# EAGLE design tic_tac_toe_wire (EAGLE 6.4)
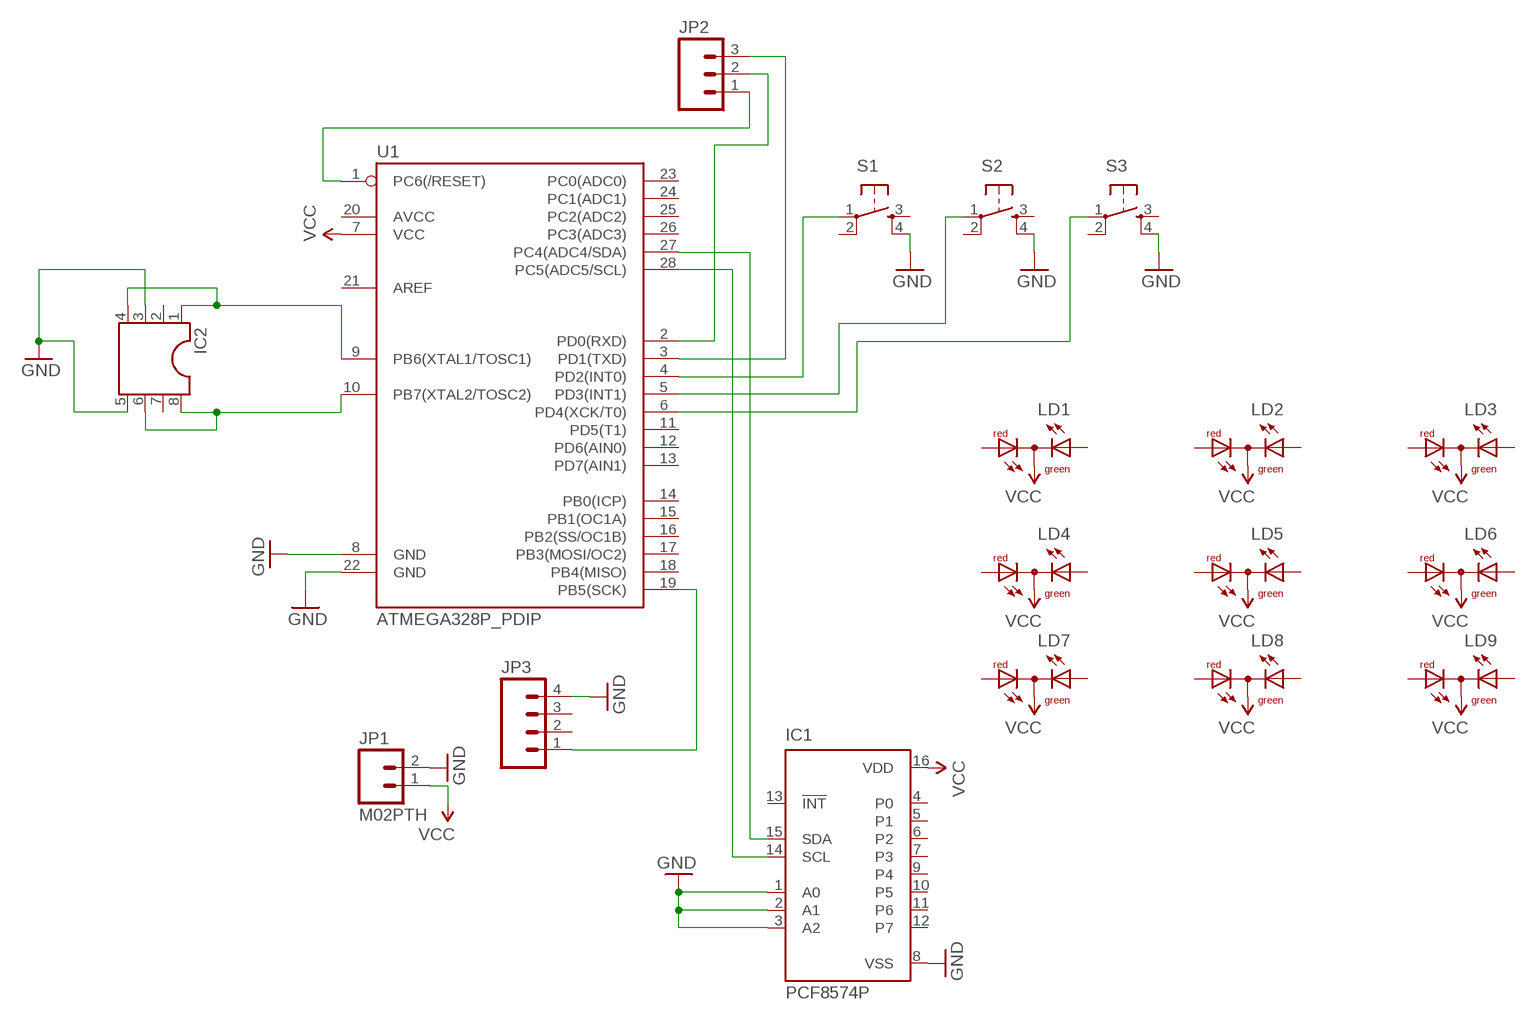
[diagram p0: schematic, sheet 1]

## Parts
IC1  PCF8574P  [DIL16]
IC2  DIL8S  [SOCKET-08]
JP1  M02PTH  [1X02]
JP2  M03PTH  [1X03]
JP3  M04PTH  [1X04]
LD1  DUOLED-RG-C  [DUOLED-C-5MM]
LD2  DUOLED-RG-C  [DUOLED-C-5MM]
LD3  DUOLED-RG-C  [DUOLED-C-5MM]
LD4  DUOLED-RG-C  [DUOLED-C-5MM]
LD5  DUOLED-RG-C  [DUOLED-C-5MM]
LD6  DUOLED-RG-C  [DUOLED-C-5MM]
LD7  DUOLED-RG-C  [DUOLED-C-5MM]
LD8  DUOLED-RG-C  [DUOLED-C-5MM]
LD9  DUOLED-RG-C  [DUOLED-C-5MM]
S1  TAC_SWITCHPTH  [TACTILE-PTH]
S2  TAC_SWITCHPTH  [TACTILE-PTH]
S3  TAC_SWITCHPTH  [TACTILE-PTH]
U1  ATMEGA328P_PDIP  [DIL28-3]

## Nets
GND: IC1.1(A0) IC1.2(A1) IC1.3(A2) IC1.8(VSS) IC2.3 IC2.5 JP1.2 JP3.4 S1.4 S2.4 S3.4 U1.8(GND) U1.22(GND)
N$1: S1.1 U1.4(PD2(INT0))
N$2: S2.1 U1.5(PD3(INT1))
N$3: S3.1 U1.6(PD4(XCK/T0))
N$4: IC1.14(SCL) U1.28(PC5(ADC5/SCL))
N$5: IC1.15(SDA) U1.27(PC4(ADC4/SDA))
N$6: JP2.2 U1.2(PD0(RXD))
N$7: JP2.1 U1.1(PC6(/RESET))
N$8: JP2.3 U1.3(PD1(TXD))
N$10: JP3.1 U1.19(PB5(SCK))
N$12: IC2.6 IC2.8 U1.10(PB7(XTAL2/TOSC2))
N$13: IC2.1 IC2.4 U1.9(PB6(XTAL1/TOSC1))
VCC: IC1.16(VDD) JP1.1 LD1.C LD2.C LD3.C LD4.C LD5.C LD6.C LD7.C LD8.C LD9.C U1.7(VCC)
Unconnected: IC1.4(P0) IC1.5(P1) IC1.6(P2) IC1.7(P3) IC1.9(P4) IC1.10(P5) IC1.11(P6) IC1.12(P7) IC1.13(!INT) IC2.2 IC2.7 JP3.2 JP3.3 LD1.AR LD1.AX(AG) LD2.AR LD2.AX(AG) LD3.AR LD3.AX(AG) LD4.AR LD4.AX(AG) LD5.AR LD5.AX(AG) LD6.AR LD6.AX(AG) LD7.AR LD7.AX(AG) LD8.AR LD8.AX(AG) LD9.AR LD9.AX(AG) S1.2 S1.3 S2.2 S2.3 S3.2 S3.3 U1.11(PD5(T1)) U1.12(PD6(AIN0)) U1.13(PD7(AIN1)) U1.14(PB0(ICP)) U1.15(PB1(OC1A)) U1.16(PB2(SS/OC1B)) U1.17(PB3(MOSI/OC2)) U1.18(PB4(MISO)) U1.20(AVCC) U1.21(AREF) U1.23(PC0(ADC0)) U1.24(PC1(ADC1)) U1.25(PC2(ADC2)) U1.26(PC3(ADC3))

## Library data of the parts
IC1 = micro-philips:PCF8574: I2C-Bus Remote 8-bit I/O expander http://www.semiconductors.philips.com/acrobat_download/datasheets/PCF8574_4.pdf; MPN: PCF8574PN; OC_FARNELL: 204020; OC_NEWARK: 11N8515
IC2 = ic-package:DIL8: Dual In Line / Socket
JP1 = SparkFun-Connectors:M02: Standard 2-pin 0.1" header. Use with - straight break away headers ( PRT-00116) - right angle break away headers (PRT-00553) - swiss pins (PRT-00743) - machine pins (PRT-00117) - female headers (PRT-00115) Molex polarized connector foot print use with: PRT-08233 with associated crimp pins and housings. 2.54_SCREWTERM for use with PRT-10571. 3.5mm Screw Terminal footprints for PRT-08084 5mm Screw Terminal footprints for use with PRT-08433
JP2 = SparkFun-Connectors:M03: Header 3 Standard 3-pin 0.1" header. Use with straight break away headers (SKU : PRT-00116), right angle break away headers (PRT-00553), swiss pins (PRT-00743), machine pins (PRT-00117), and female headers (PRT-00115). Molex polarized connector foot print use with SKU : PRT-08232 with associated crimp pins and housings.
JP3 = SparkFun-Connectors:M04: Header 4 Standard 4-pin 0.1" header. Use with straight break away headers (SKU : PRT-00116), right angle break away headers (PRT-00553), swiss pins (PRT-00743), machine pins (PRT-00117), and female headers (PRT-00115). Molex polarized connector foot print use with SKU : PRT-08231 with associated crimp pins and housings. 1MM SMD Version SKU: PRT-10208
LD1-LD9 = led:DUOLED-RG-C: DUO LED 2 colors (red/green), 5 mm, round, common Cathode www.ligitek.com or other producers.
S1-S3 = SparkFun-Electromechanical:TAC_SWITCH: Momentary Switch Button commonly used for reset or general input. Spark Fun Electronics SKU : COM-00097 SMT- SWCH-08247
U1 = SparkFun-DigitalIC:ATMEGA328P_PDIP: uC used in the Arduino 32kb flash, 1k EEPROM, 2k SRAM This is the through-hole version of this chip.

## Net classes
0 default: width 0.406 mm, drill 0.508 mm, clearance 0.254 mm

## Board
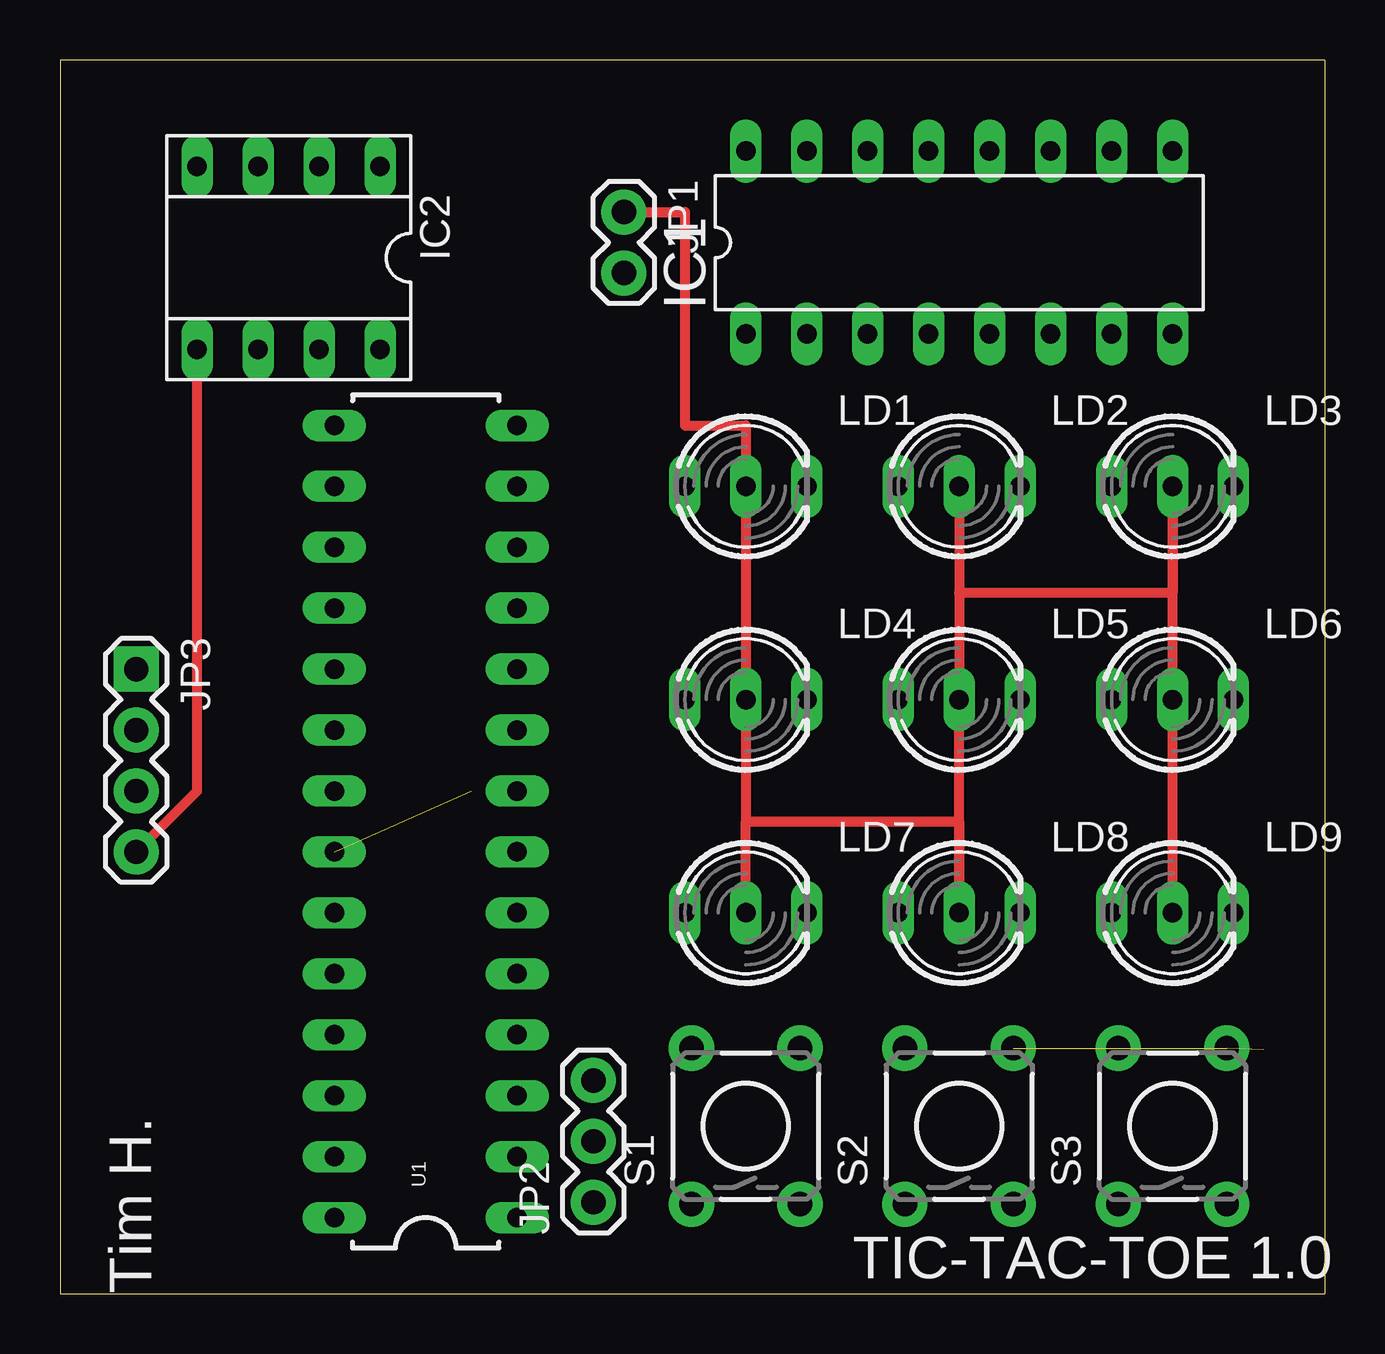
[diagram p1: board, top side]
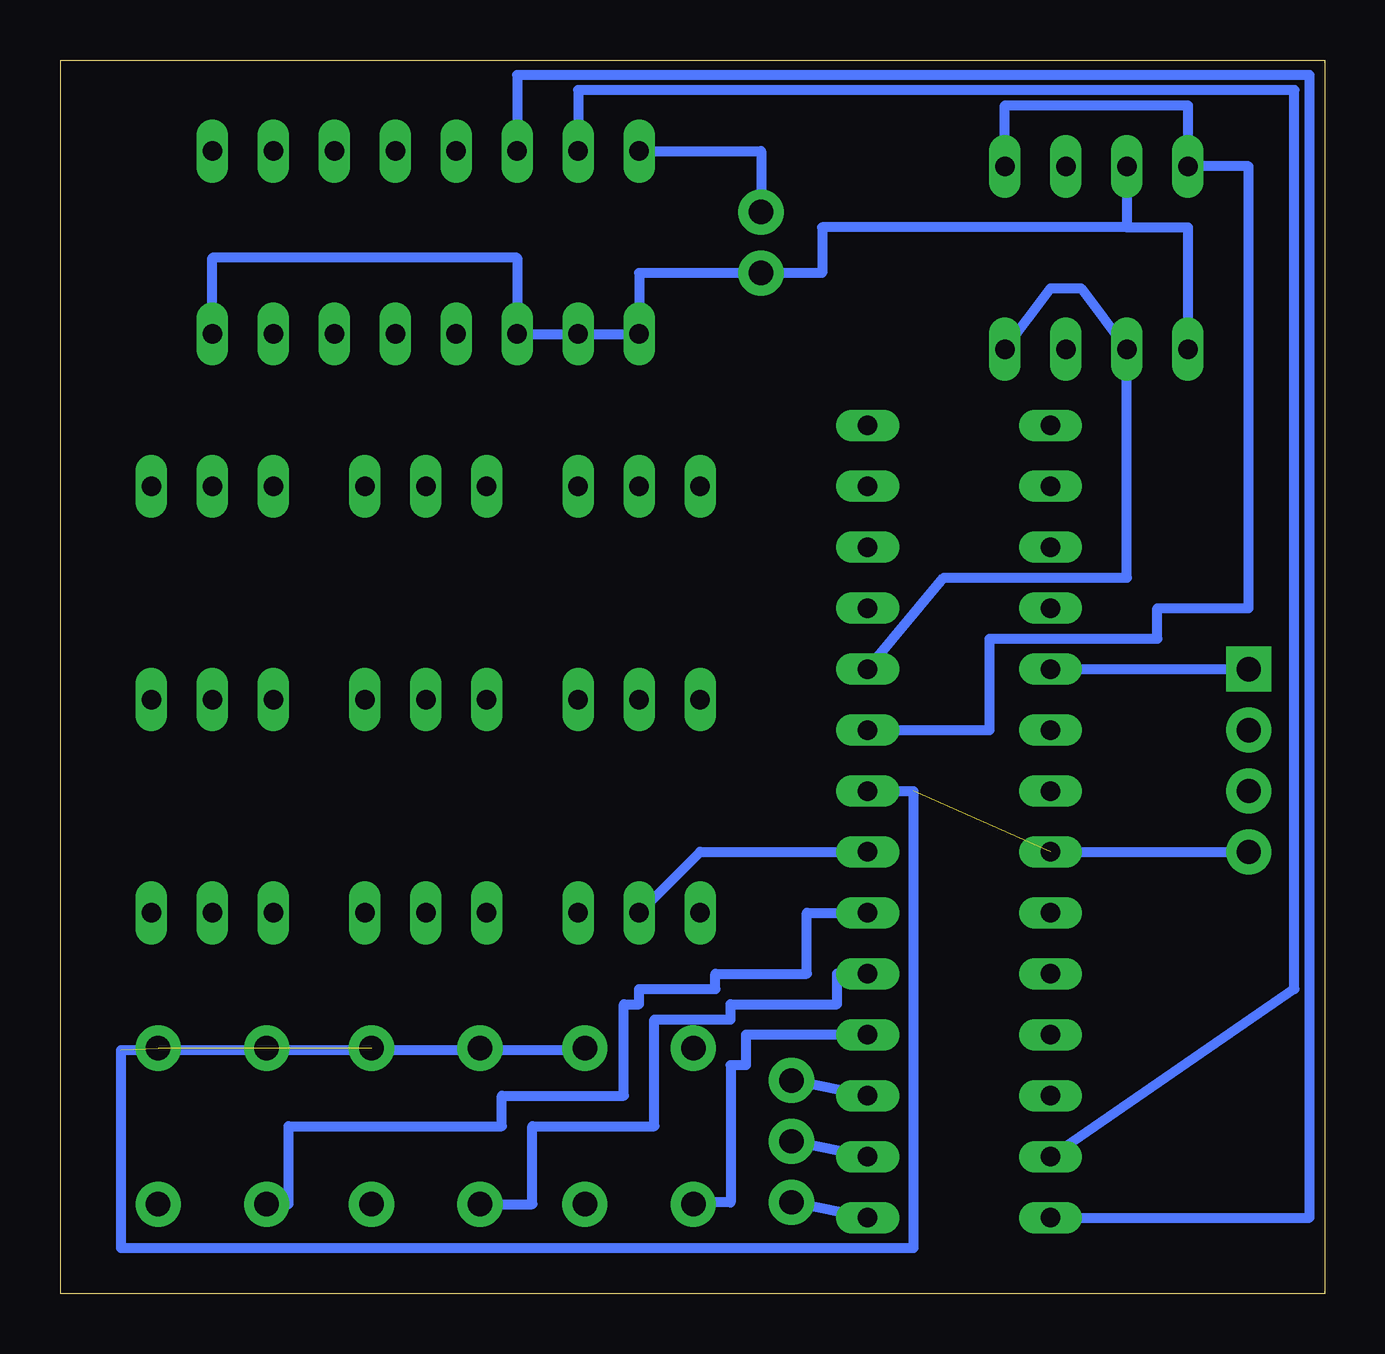
[diagram p2: board, bottom side, seen from below]

Size 52.7 x 51.42 mm. Coordinates in mm from the lower left corner, seen from the top.
Outline: 0,0 52.7,0 52.7,51.42 0,51.42 0,0
Copper layers (1*16): Top 0.035mm / dielectric 1.5mm / Bottom 0.035mm
Design rules "default": minimum track width 10mil, minimum drill 24mil, track to track 8mil, track to pad 8mil, pad to pad 8mil, via to via 8mil, smd to smd 8mil, copper to edge 40mil, drill to drill 8mil, minimum pad ring 10mil, minimum via ring 8mil, stop-mask expansion 4mil, vias tented up to drill 0mil, thermal gap 10mil

### Footprints (pad centres in the part's own frame; a part is rotated, then mirrored left to right if it is on the bottom)
DIL16 = drill 0.813 long: 1 -8.89,-3.81; 2 -6.35,-3.81; 3 -3.81,-3.81; 4 -1.27,-3.81; 5 1.27,-3.81; 6 3.81,-3.81; 7 6.35,-3.81; 8 8.89,-3.81; 9 8.89,3.81; 10 6.35,3.81; 11 3.81,3.81; 12 1.27,3.81; 13 -1.27,3.81; 14 -3.81,3.81; 15 -6.35,3.81; 16 -8.89,3.81
SOCKET-08 = drill 0.813 long: 1 -3.81,-3.81; 2 -1.27,-3.81; 3 1.27,-3.81; 4 3.81,-3.81; 5 3.81,3.81; 6 1.27,3.81; 7 -1.27,3.81; 8 -3.81,3.81
1X02 = drill 1.016 pad 1.88: 1 0,0; 2 2.54,0
1X03 = drill 1.016 pad 1.88: 1 0,0; 2 2.54,0; 3 5.08,0
1X04 = drill 1.016 pad 1.88 square: 1 0,0 | drill 1.016 pad 1.88: 2 2.54,0; 3 5.08,0; 4 7.62,0
DUOLED-C-5MM = drill 0.813 long: AR 2.54,0; AX -2.54,0; C 0,0
TACTILE-PTH = drill 1.016 pad 1.88: 1 -3.251,2.261; 2 3.251,2.261; 3 -3.251,-2.261; 4 3.251,-2.261
DIL28-3 = drill 0.813 long: 1 -16.51,-3.81; 2 -13.97,-3.81; 3 -11.43,-3.81; 4 -8.89,-3.81; 5 -6.35,-3.81; 6 -3.81,-3.81; 7 -1.27,-3.81; 8 1.27,-3.81; 9 3.81,-3.81; 10 6.35,-3.81; 11 8.89,-3.81; 12 11.43,-3.81; 13 13.97,-3.81; 14 16.51,-3.81; 15 16.51,3.81; 16 13.97,3.81; 17 11.43,3.81; 18 8.89,3.81; 19 6.35,3.81; 20 3.81,3.81; 21 1.27,3.81; 22 -1.27,3.81; 23 -3.81,3.81; 24 -6.35,3.81; 25 -8.89,3.81; 26 -11.43,3.81; 27 -13.97,3.81; 28 -16.51,3.81

### Placement (x,y rotation side)
IC1  37.47,43.81 0 top
IC2  9.53,43.18 180 top
JP1  23.5,45.09 270 top
JP2  22.23,3.81 90 top
JP3  3.17,26.04 270 top
LD1  28.57,33.66 0 top
LD2  37.47,33.66 0 top
LD3  46.35,33.66 0 top
LD4  28.57,24.77 0 top
LD5  37.47,24.77 0 top
LD6  46.35,24.77 0 top
LD7  28.57,15.88 0 top
LD8  37.47,15.88 0 top
LD9  46.35,15.88 0 top
S1  28.57,6.99 90 top
S2  37.47,6.99 90 top
S3  46.35,6.99 90 top
U1  15.24,19.68 90 top

### Tracks (layer width: path | path; a pad name or v marks a point on that pad's centre or on a via)
GND  (3 unrouted)
  Top 0.406: IC2.5 5.71,20.95 JP3.4
  Bottom 0.406: IC1.8 46.35,43.18 33.66,43.18 IC1.3 IC1.2 IC1.1 28.57,42.55 JP1.2 20.95,42.55 20.95,44.45 8.26,44.45 | IC2.3 8.26,44.45 | S1.4 30.84,10.16 50.16,10.16 50.16,1.91 17.14,1.91 17.14,20.95 U1.8 | 8.26,44.45 5.71,44.45 IC2.5 | U1.22 JP3.4
N$1
  Bottom 0.406: 26.67,3.81 S1.1 26.31,3.81 24.77,3.81 24.77,9.53 24.13,9.53 24.13,10.79 U1.4
N$2
  Bottom 0.406: S2.1 33.02,3.73 33.02,6.99 27.94,6.99 27.94,11.43 24.77,11.43 24.77,12.06 20.32,12.06 20.32,13.34 U1.5
N$3
  Bottom 0.406: 44.45,3.81 S3.1 43.18,3.73 43.18,6.99 34.29,6.99 34.29,8.26 29.21,8.26 29.21,12.06 28.57,12.06 28.57,12.7 25.4,12.7 25.4,13.34 21.59,13.34 21.59,15.88 U1.6
N$4
  Bottom 0.406: U1.28 0.64,3.17 0.64,50.8 33.66,50.8 IC1.14
N$5
  Bottom 0.406: U1.27 1.27,12.7 1.27,50.16 31.11,50.16 IC1.15
N$6
  Bottom 0.406: U1.2 JP2.2
N$7
  Bottom 0.406: U1.1 JP2.1
N$8
  Bottom 0.406: U1.3 JP2.3
N$10
  Bottom 0.406: U1.19 JP3.1
N$12
  Bottom 0.406: IC2.8 11.43,41.91 10.16,41.91 IC2.6 8.26,29.84 15.88,29.84 U1.10
N$13
  Bottom 0.406: IC2.1 13.34,49.53 5.71,49.53 IC2.4 3.17,46.99 3.17,28.57 6.99,28.57 6.99,27.3 13.97,27.3 13.97,23.5 U1.9
VCC
  Top 0.406: 28.57,19.68 LD4.C LD1.C 28.57,36.2 26.04,36.2 26.04,45.09 JP1.1 | LD7.C 28.57,19.68 | 28.57,19.68 37.47,19.68 LD8.C LD5.C 37.47,29.21 | LD2.C 37.47,29.21 | LD9.C LD6.C LD3.C 46.35,29.21 37.47,29.21
  Bottom 0.406: IC1.16 23.5,47.62 JP1.1 | U1.7 26.04,18.41 LD7.C

### Text on the board
tPlace: TIC-TAC-TOE 1.0 | Tim H.